# Altium schematic sheet Radio.SchDoc
size A; SheetNumber: 2; SheetTotal: 3
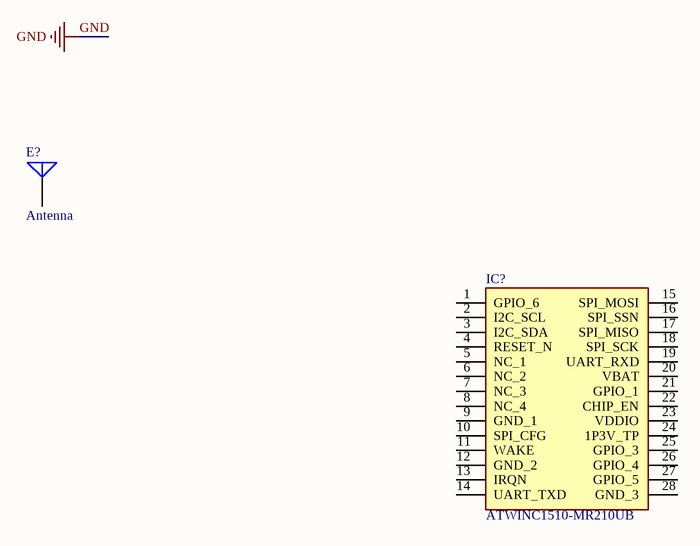
[diagram p0: Radio.SchDoc]

## Parts
E?  Antenna  [PIN1]
IC?  ATWINC1510-MR210UB  [ATWINC1510MR210UB]

## Nets

Not connected (* = marked no-connect by the designer): E? 1(A); IC? 1(GPIO_6) 2(I2C_SCL) 3(I2C_SDA) 4(RESET_N) 5(NC_1) 6(NC_2) 7(NC_3) 8(NC_4) 9(GND_1) 10(SPI_CFG) 11(WAKE) 12(GND_2) 13(IRQN) 14(UART_TXD) 15(SPI_MOSI) 16(SPI_SSN) 17(SPI_MISO) 18(SPI_SCK) 19(UART_RXD) 20(VBAT) 21(GPIO_1) 22(CHIP_EN) 23(VDDIO) 24(1P3V_TP) 25(GPIO_3) 26(GPIO_4) 27(GPIO_5) 28(GND_3)

## Library data of the parts
E? = Antenna: Generic Antenna; Published: 24-Mar-1999; LatestRevisionDate: 17-Jul-2002; LatestRevisionNote: Re-released for DXP Platform.; PackageReference: PIN1; Publisher: Altium Limited
IC? = ATWINC1510-MR210UB: Integrated Circuit; Manufacturer_Name: Microchip; Datasheet Link: http://ww1.microchip.com/downloads/en/DeviceDoc/70005304B.pdf; Height: 2.113mm; Manufacturer_Part_Number: ATWINC1510-MR210UB; Mouser Part Number: 556-ATWINC1510MR210U; Mouser Price/Stock: https://www.mouser.co.uk/ProductDetail/Microchip-Technology/ATWINC1510-MR210UB?qs=QB0ovJDgFgt5QuIkS9qN8w%3D%3D; Arrow Part Number: ATWINC1510-MR210UB; Arrow Price/Stock: https://www.arrow.com/en/products/atwinc1510-mr210ub/microchip-technology